# Altium schematic sheet MP-Mosaic.SchDoc
size A4; SheetNumber: 1; SheetTotal: 7
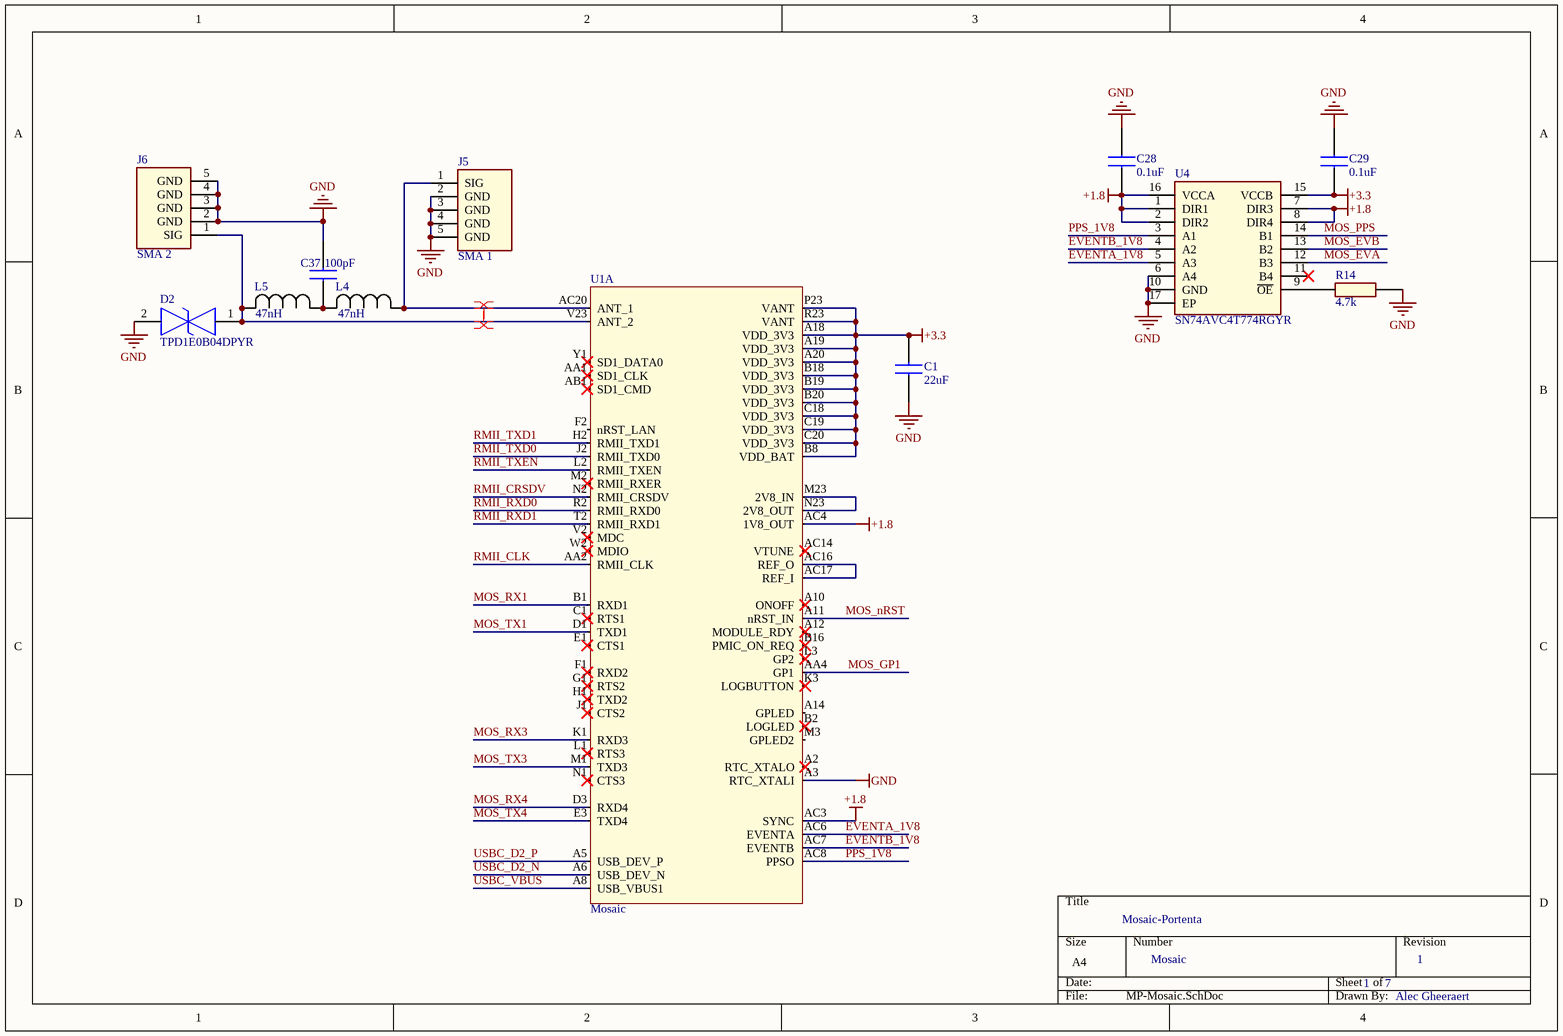
[diagram p0: MP-Mosaic.SchDoc]

## Parts
C1  22uF  [CAPC2012X145N]
C28  0.1uF  [CAPC1005X55N]
C29  0.1uF  [CAPC1005X55N]
C37  100pF  [CAPC0603X35N]
D2  TPD1E0B04DPYR  [TPD1E0B04DPYR]
J5  SMA 1  [3-1478978-1]
J6  SMA 2  [3-1478978-1]
L4  47nH  [IND_1005_TDK]
L5  47nH  [IND_1005_TDK]
R14  4.7k  [RESC1005X40N]
U1  Mosaic  [Mosaic]  (part A of 3)
U4  SN74AVC4T774RGYR  [SN74AVC4T774RGYR]

## Nets
+1.8: C28.1 U1.AC3(SYNC) U1.AC4(1V8_OUT) U4.1(DIR1) U4.2(DIR2) U4.7(DIR3) U4.8(DIR4) U4.16(VCCA)
+3.3: C1.1 C29.1 U1.A18(VDD_3V3) U1.A19(VDD_3V3) U1.A20(VDD_3V3) U1.B8(VDD_BAT) U1.B18(VDD_3V3) U1.B19(VDD_3V3) U1.B20(VDD_3V3) U1.C18(VDD_3V3) U1.C19(VDD_3V3) U1.C20(VDD_3V3) U1.P23(VANT) U1.R23(VANT) U4.15(VCCB)
GND: C1.2 C28.2 C29.2 C37.2 D2.2 J5.2(GND) J5.3(GND) J5.4(GND) J5.5(GND) J6.2(GND) J6.3(GND) J6.4(GND) J6.5(GND) R14.2 U1.A3(RTC_XTALI) U4.6(A4) U4.10(GND) U4.17(EP)
EVENTA_1V8: U1.AC6(EVENTA) U4.5(A3)
EVENTB_1V8: U1.AC7(EVENTB) U4.4(A2)
MOS_EVA: U4.12(B3)
MOS_EVB: U4.13(B2)
MOS_GP1: U1.AA4(GP1)
MOS_nRST: U1.A11(nRST_IN)
MOS_PPS: U4.14(B1)
MOS_RX1: U1.B1(RXD1)
MOS_RX3: U1.K1(RXD3)
MOS_RX4: U1.D3(RXD4)
MOS_TX1: U1.D1(TXD1)
MOS_TX3: U1.M1(TXD3)
MOS_TX4: U1.E3(TXD4)
PPS_1V8: U1.AC8(PPSO) U4.3(A1)
RMII_CLK: U1.AA2(RMII_CLK)
RMII_CRSDV: U1.N2(RMII_CRSDV)
RMII_RXD0: U1.R2(RMII_RXD0)
RMII_RXD1: U1.T2(RMII_RXD1)
RMII_TXD0: U1.J2(RMII_TXD0)
RMII_TXD1: U1.H2(RMII_TXD1)
RMII_TXEN: U1.L2(RMII_TXEN)
USBC_D2_N: U1.A6(USB_DEV_N)
USBC_D2_P: U1.A5(USB_DEV_P)
USBC_VBUS: U1.A8(USB_VBUS1)
NetC37_1: C37.1 L4.2 L5.1
NetD2_1: D2.1 J6.1(SIG) L5.2 U1.V23(ANT_2)
NetJ5_1: J5.1(SIG) L4.1 U1.AC20(ANT_1)
NetR14_1: R14.1 U4.9(~{OE})
NetU1_AC16: U1.AC16(REF_O) U1.AC17(REF_I)
NetU1_M23: U1.M23(2V8_IN) U1.N23(2V8_OUT)

Not connected (* = marked no-connect by the designer): U1 A2(RTC_XTALO)* A10(ONOFF)* A12(MODULE_RDY)* A14(GPLED) AA1(SD1_CLK)* AB1(SD1_CMD)* AC14(VTUNE)* B2(LOGLED)* B16(PMIC_ON_REQ)* C1(RTS1)* E1(CTS1)* F1(RXD2)* F2(nRST_LAN) G1(RTS2)* H1(TXD2)* J1(CTS2)* K3(LOGBUTTON)* L1(RTS3)* L3(GP2)* M2(RMII_RXER)* M3(GPLED2) N1(CTS3)* V2(MDC)* W2(MDIO)* Y1(SD1_DATA0)*; U4 11(B4)*

## Layout directives
net class ANT: NetD2_1, NetJ5_1

## Notes on the sheet
- Mosaic-Portenta
- Mosaic
- 1
- 7
- Alec Gheeraert

## Library data of the parts
C1 = CMP-00053-2: 0805 22µF; Manufacturer: Walsin; Tolerance: 10%; Dielectric: X5R; Voltage Rating: 6.3V; Min Operating Temperature: 85; Capacitance: 22µF; Max Operating Temperature: -55; Package: 0805
C28 C29 = CMP-00051-3: 0402I 0.1µF; Manufacturer: Walsin; Tolerance: 10%; Dielectric: X7R; Capacitance: 100nF; Voltage Rating: 10V; Min Operating Temperature: -55; Package: 0402; Max Operating Temperature: 125
C37 = CMP-00074-2: 0201 100pF; Capacitance: 100pF
D2 = CMP-00073-2: 1 Channel TVS Diode
J5 J6 = CMP-00069-3: RF SMA Connector
L4 L5 = CMP-00072-2: 47nH 1.4GHz Inductor
R14 = CMP-00030-4: 0402I 4.7k; Manufacturer: Walsin; Power Rating: 62.5mW; Qualification: AEC-Q200; Voltage Rating: 50V; Tolerance: 1%; Max Operating Temperature: 155; Package: 0402; Min Operating Temperature: -55; Resistance: 4.7k
U1 = CMP-00046-3: GNSS RTK Receiver; Manufacturer: Septentrio; Interfaces: USB, UART; Min Operating Temperature: -40; Max Operating Temperature: 85
U4 = CMP-00060-4: 4B Dual-Supply Level Shifter; Manufacturer: Texas Instruments; Delay Time: 2.4ns; Max Supply Voltage: 3.6V; Data Rate: 380Mb/s; Bits: 4; Min Supply Voltage: 1.2V; Package: VQFN-16